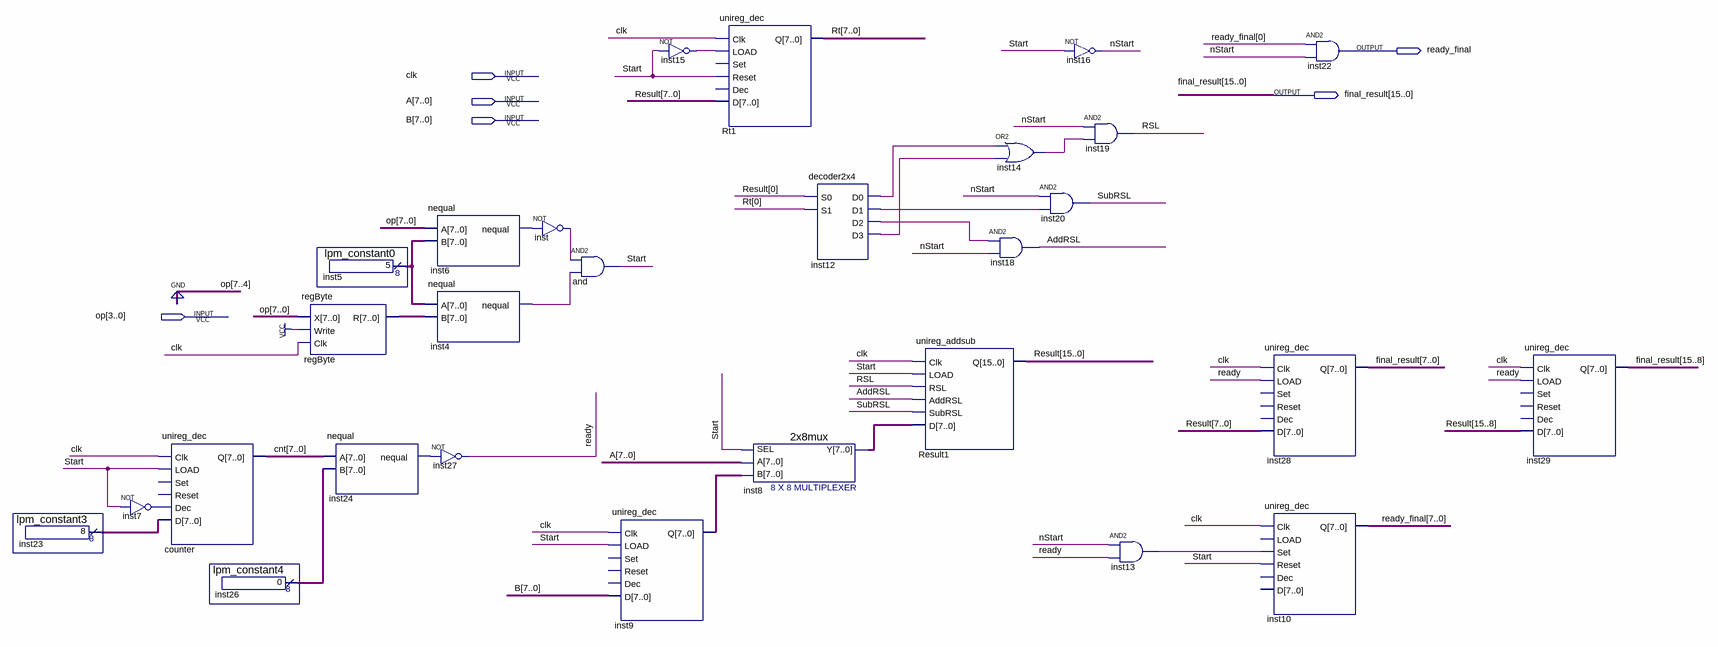
[diagram p0: schematic sheet]
// Quartus schematic boothmultByte.bdf as structural Verilog: 28 symbols, 6 pins
module boothmultByte (
  input  clk,
  input  [7:0] A,
  input  [7:0] B,
  input  [3:0] op,
  output ready_final,
  output [15:0] final_result
);

  wire AddRSL, inst4_nequal, inst6_nequal, inst7_out, inst12_d0, inst12_d1, inst12_d2, inst12_d3, inst13_out,
       inst14_out, inst15_out, inst24_nequal, inst_out, nStart, ready, RSL, Start, SubRSL;
  wire [7:0] cnt, inst5_result, inst8_y, inst9_q, inst23_result, inst26_result, ready_final_bus, regByte_r,
       Rt;
  wire [15:0] Result;

  lpm_constant3 inst23 (.result(inst23_result));
  not inst7 (inst7_out, Start);
  unireg_dec counter (.Clk(clk), .LOAD(Start), .Dec(inst7_out), .D(inst23_result), .Q(cnt));  // open: Set, Reset
  lpm_constant4 inst26 (.result(inst26_result));
  lpm_constant0 inst5 (.result(inst5_result));
  regByte regByte (.X({4'b0000, op}), .Write(1'b1), .Clk(clk), .R(regByte_r));
  nequal inst24 (.A(cnt), .B(inst26_result), .nequal(inst24_nequal));
  nequal inst6 (.A({4'b0000, op}), .B(inst5_result), .nequal(inst6_nequal));
  nequal inst4 (.A(inst5_result), .B(regByte_r), .nequal(inst4_nequal));
  not inst27 (ready, inst24_nequal);
  not inst (inst_out, inst6_nequal);
  and \and  (Start, inst_out, inst4_nequal);
  unireg_dec inst9 (.Clk(clk), .LOAD(Start), .D(B), .Q(inst9_q));  // open: Set, Reset, Dec
  not inst15 (inst15_out, Start);
  unireg_dec Rt1 (.Clk(clk), .LOAD(inst15_out), .Reset(Start), .D(Result[7:0]), .Q(Rt));  // open: Set, Dec
  \2x8mux  inst8 (.SEL(Start), .A(A), .B(inst9_q), .Y(inst8_y));
  decoder2x4 inst12 (.S0(Result[0]), .S1(Rt[0]), .D0(inst12_d0), .D1(inst12_d1), .D2(inst12_d2), .D3(inst12_d3));
  unireg_addsub Result1 (.Clk(clk), .LOAD(Start), .RSL(RSL), .AddRSL(AddRSL), .SubRSL(SubRSL), .D(inst8_y), .Q(Result));
  and inst18 (AddRSL, inst12_d2, nStart);
  or inst14 (inst14_out, inst12_d0, inst12_d3);
  and inst20 (SubRSL, nStart, inst12_d1);
  not inst16 (nStart, Start);
  and inst19 (RSL, nStart, inst14_out);
  and inst13 (inst13_out, nStart, ready);
  unireg_dec inst28 (.Clk(clk), .LOAD(ready), .D(Result[7:0]), .Q(final_result[7:0]));  // open: Set, Reset, Dec
  unireg_dec inst10 (.Clk(clk), .Set(inst13_out), .Reset(Start), .Q(ready_final_bus));  // open: LOAD, Dec, D
  and inst22 (ready_final, ready_final_bus[0], nStart);
  unireg_dec inst29 (.Clk(clk), .LOAD(ready), .D(Result[15:8]), .Q(final_result[15:8]));  // open: Set, Reset, Dec
endmodule
